# Altium schematic sheet Client_Node_Block_Diagram.SchDoc: Project_Vega_Client_Node_Block_Diagram
size A4; DrawnBy: Project_Vega_Team; Revision: 1; SheetNumber: 6; SheetTotal: 8
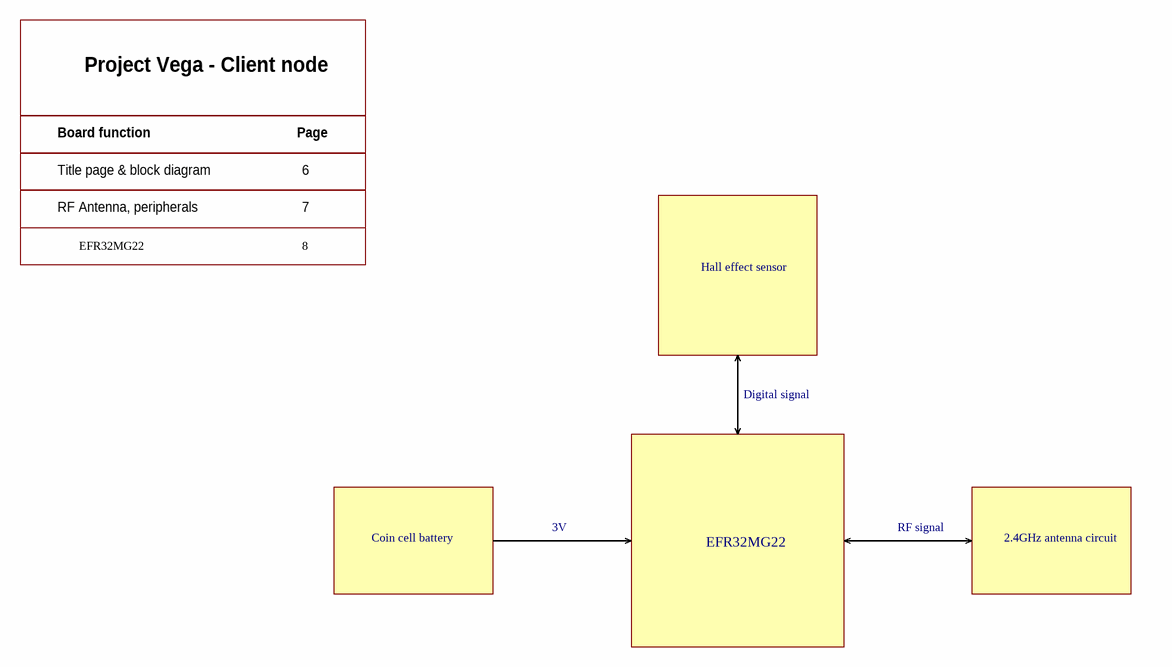
[diagram p0: Client_Node_Block_Diagram.SchDoc]

## Notes on the sheet
- Project Vega - Client node
- Board function
- Page
- Title page & block diagram
- RF Antenna, peripherals
- 6
- 7
- EFR32MG22
- 8
- Hall effect sensor
- Digital signal
- Coin cell battery
- 3V
- RF signal
- 2.4GHz antenna circuit